# EAGLE design ConnectorBoard (EAGLE 9.6.2)
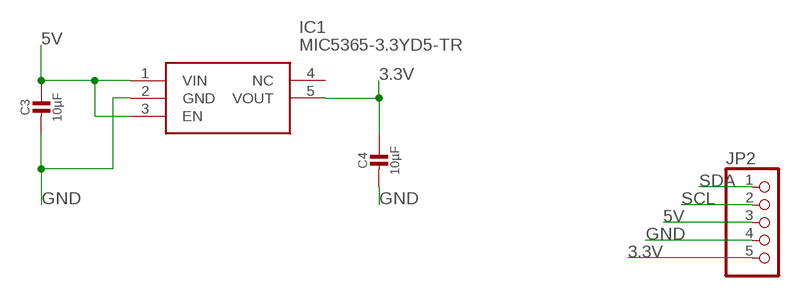
[diagram p0: schematic, sheet 1]

## Parts
C3  10µF  CAP_CERAMIC0805-NOOUTLINE  [0805-NO]
C4  10µF  CAP_CERAMIC0805-NOOUTLINE  [0805-NO]
IC1  MIC5365-3.3YD5-TR  [SOT95P280X100-5N]
JP2  PINHD-1X55X2MM  [1_05X2MM]

## Nets
3.3V: C4.1 IC1.5(VOUT) JP2.5
5V: C3.1 IC1.1(VIN) IC1.3(EN) JP2.3
GND: C3.2 C4.2 IC1.2(GND) JP2.4
SCL: JP2.2
SDA: JP2.1
Unconnected: IC1.4(NC)

## Library data of the parts
C3 C4 = microbuilder:CAP_CERAMIC: Ceramic Capacitors For new designs, use the packages preceded by an '_' character since they are more reliable: The following footprints should be used on most boards: _0402 - Standard footprint for regular board layouts _0603 - Standard footprint for regular board layouts _0805 - Standard footprint for regular board layouts _1206 - Standard footprint for regular board layouts For extremely tight-pitch boards where space is at a premium, the following 'micro-pitch' footprints can be used (smaller pads, no silkscreen outline, etc.): _0402MP - Micro-pitch footprint for very dense/compact boards _0603MP - Micro-pitch footprint for very dense/compact boards _0805MP - Micro-pitch footprint for very dense/compact boards _1206MP - Micro-pitch footprint for very dense/compact boards
IC1 = SamacSys_Parts:MIC5365-3.3YD5-TR: LDO Voltage Regulators Ultra Small Single 150mA LDO Source: Datasheet <https://ww1.microchip.com/downloads/en/DeviceDoc/mic5365.pdf>; DESCRIPTION: LDO Voltage Regulators Ultra Small Single 150mA LDO; HEIGHT: 1mm; MANUFACTURER_NAME: Microchip; MANUFACTURER_PART_NUMBER: MIC5365-3.3YD5-TR; MOUSER_PART_NUMBER: 998-MIC5365-3.3YD5TR; MOUSER_PRICE-STOCK: https://www.mouser.co.uk/ProductDetail/Microchip-Technology-Micrel/MIC5365-33YD5-TR/?qs=U6T8BxXiZAXzRinbbfZRrg%3D%3D
JP2 = pinhead:PINHD-1X5: PIN HEADER

## Board
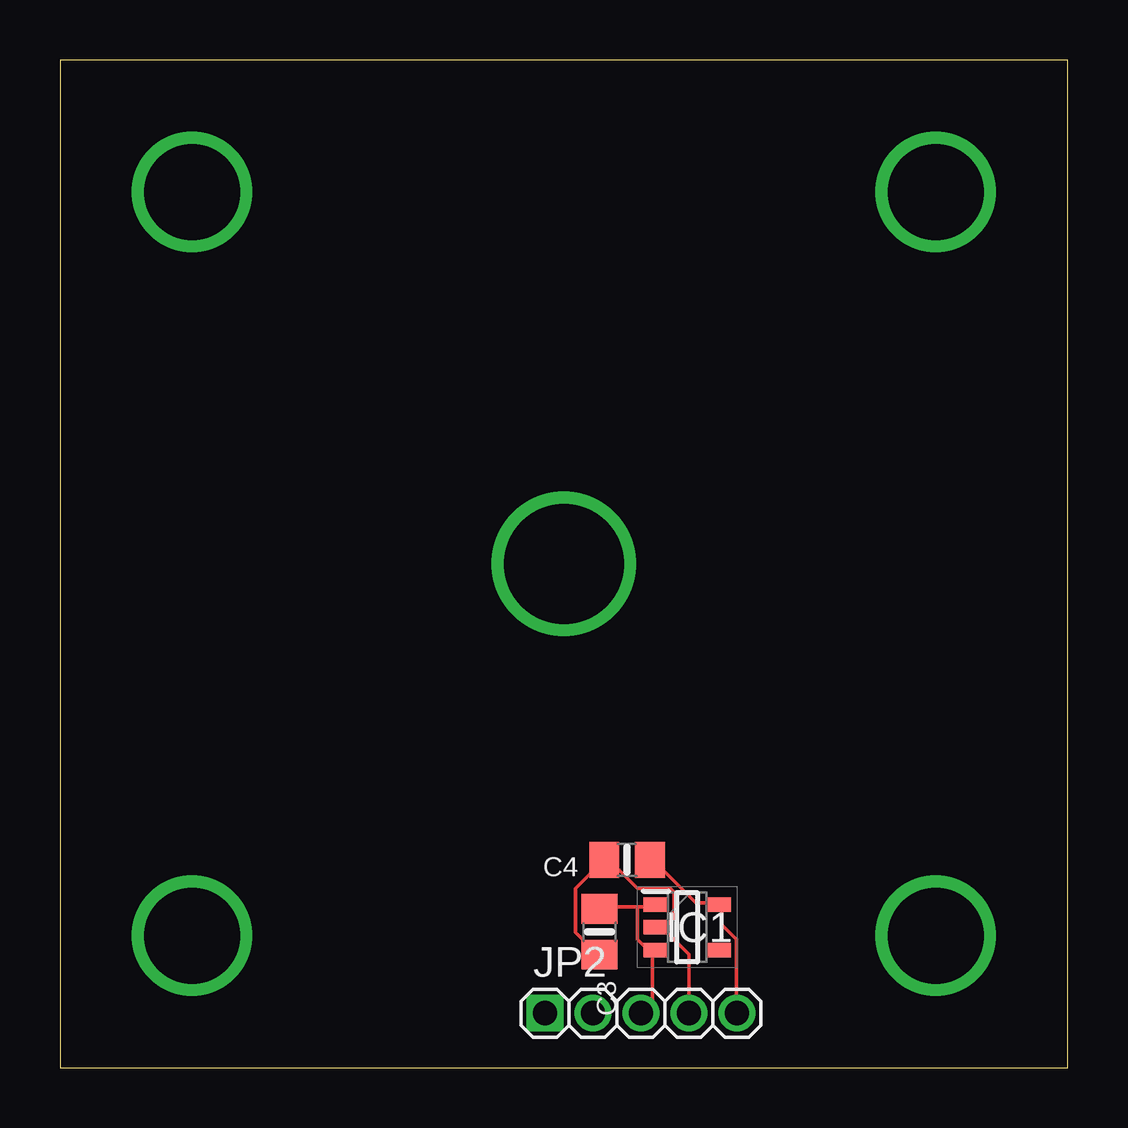
[diagram p1: board, top side]

Size 42 x 42 mm. Coordinates in mm from the lower left corner, seen from the top.
Outline: 0,0 42,0 42,42 0,42 0,0
Copper layers (1*16): Top 0.035mm / dielectric 1.5mm / Bottom 0.035mm
Design rules "default": minimum track width 6mil, minimum drill 0.35mm, track to track 6mil, track to pad 6mil, pad to pad 6mil, via to via 6mil, smd to smd 6mil, copper to edge 40mil, drill to drill 6mil, minimum pad ring 10mil, minimum via ring 8mil, stop-mask expansion 4mil, vias tented up to drill 0mil, thermal gap 10mil

### Footprints (pad centres in the part's own frame; a part is rotated, then mirrored left to right if it is on the bottom)
0805-NO = smd 1.24 x 1.5: 1 -0.95,0; 2 0.95,0
SOT95P280X100-5N = smd 1.05 x 0.6: 1 -1.3,0.95; 2 -1.3,0; 3 -1.3,-0.95; 4 1.3,-0.95; 5 1.3,0.95
1_05X2MM = drill 1.016 pad 1.3 square: 1 -4,0 | drill 1.016 pad 1.3: 2 -2,0; 3 0,0; 4 2,0; 5 4,0

### Placement (x,y rotation side)
C3  22.49,5.66 270 top
C4  23.64,8.66 180 top
IC1  26.14,5.85 0 top
JP2  24.22,2.27 0 top

### Tracks (layer width: path | path; a pad name or v marks a point on that pad's centre or on a via)
3.3V
  Top 0.152: C4.1 24.69,8.69 26.52,6.86 27.43,6.86 IC1.5 27.58,6.71 27.58,5.94 28.19,5.33 28.19,2.29 JP2.5
5V
  Top 0.152: 24.08,6.71 22.55,6.71 C3.1 | 24.08,6.71 24.69,6.71 IC1.1 | 24.69,4.72 24.69,2.74 24.23,2.29 JP2.3 | 24.69,4.72 24.69,4.88 IC1.3 24.69,4.72 | 24.08,6.71 24.08,5.33 24.69,4.72
GND
  Top 0.152: C3.2 22.4,4.72 21.49,5.64 21.49,7.47 22.55,8.53 C4.2 22.71,8.53 23.01,8.53 24.08,7.47 25.45,7.47 25.6,7.32 25.6,6.25 25.15,5.79 | 25.15,5.79 24.84,5.79 IC1.2 25.15,5.79 | 25.15,5.79 26.21,4.72 26.21,2.29 JP2.4
N$1  (via drill 4 pad 4.5)
  other vias: 36.5,5.5
N$2  (via drill 4 pad 4.5)
  other vias: 5.5,5.5
N$3  (via drill 4 pad 4.5)
  other vias: 36.5,36.5
N$4  (via drill 4 pad 4.5)
  other vias: 5.5,36.5
N$9  (via drill 5 pad 5.5)
  other vias: 21,21